# EAGLE schematic level_shifter (EAGLE 6.2)
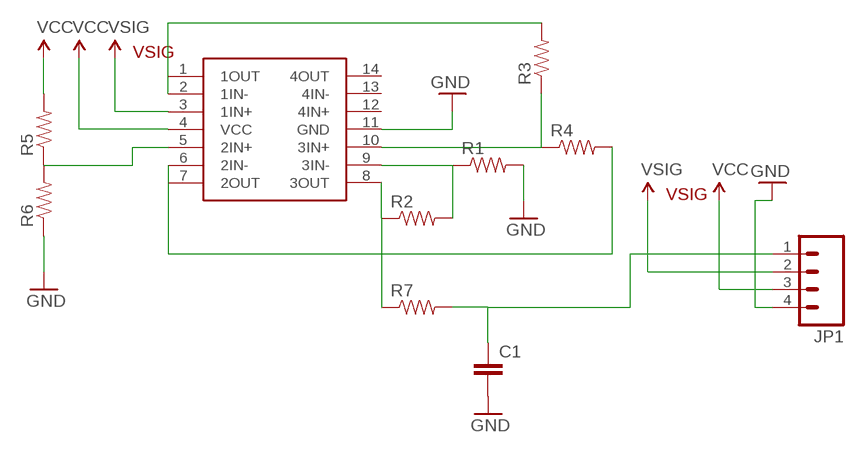
[diagram p0: schematic, sheet 1]

## Parts
C1  CAPPTH1  [CAP-PTH-5MM]
JP1  M04SCREW-5MM  [SCREWTERMINAL-5MM-4]
R1  RESISTORPTH-1/4W  [AXIAL-0.4]
R2  RESISTORPTH-1/4W  [AXIAL-0.4]
R3  RESISTORPTH-1/4W  [AXIAL-0.4]
R4  RESISTORPTH-1/4W  [AXIAL-0.4]
R5  RESISTORPTH-1/4W  [AXIAL-0.4]
R6  RESISTORPTH-1/4W  [AXIAL-0.4]
R7  RESISTORPTH-1/4W  [AXIAL-0.4]
U$1  LM324DIP  [DIL14]

## Nets
GND: C1.2 JP1.4 R1.P$2 R6.P$1 U$1.11(GND)
N$1: R3.P$2 U$1.1(1OUT) U$1.2(1IN-)
N$2: C1.1 JP1.1 R7.P$2
N$3: R4.P$2 U$1.6(2IN-) U$1.7(2OUT)
N$4: R3.P$1 R4.P$1 U$1.10(3IN+)
N$5: R5.P$1 R6.P$2 U$1.5(2IN+)
N$9: R1.P$1 R2.P$2 U$1.9(3IN-)
N$10: R2.P$1 R7.P$1 U$1.8(3OUT)
VCC: JP1.3 R5.P$2 U$1.4(VCC)
VSIG: JP1.2 U$1.3(1IN+)
Unconnected: U$1.12(4IN+) U$1.13(4IN-) U$1.14(4OUT)

## Library data of the parts
C1 = SparkFun:CAP: Capacitor Standard 0603 ceramic capacitor, and 0.1" leaded capacitor.
JP1 = SparkFun:M04: Header 4 Standard 4-pin 0.1" header. Use with straight break away headers (SKU : PRT-00116), right angle break away headers (PRT-00553), swiss pins (PRT-00743), machine pins (PRT-00117), and female headers (PRT-00115). Molex polarized connector foot print use with SKU : PRT-08231 with associated crimp pins and housings. 1MM SMD Version SKU: PRT-10208
R1-R7 = SparkFun:RESISTOR: Resistor Basic schematic elements and footprints for 0603, 1206, and PTH resistors.
U$1 = SparkFun:LM324